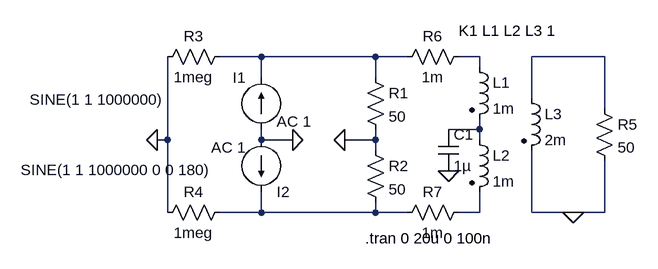
[diagram p0: schematic spice.asc]
spice.asc, the LTspice schematic file:
Version 4
SHEET 1 880 680
WIRE 0 48 -64 48
WIRE 176 48 0 48
WIRE 224 48 176 48
WIRE 336 48 304 48
WIRE 528 48 416 48
WIRE 336 64 336 48
WIRE 0 80 0 48
WIRE 176 80 176 48
WIRE 416 112 416 48
WIRE 528 128 528 48
WIRE 336 160 336 144
WIRE 336 160 288 160
WIRE -144 176 -144 48
WIRE -144 176 -160 176
WIRE 0 176 0 160
WIRE 48 176 0 176
WIRE 176 176 176 160
WIRE 176 176 128 176
WIRE 336 176 336 160
WIRE 176 192 176 176
WIRE -144 288 -144 176
WIRE 0 288 0 256
WIRE 0 288 -64 288
WIRE 176 288 176 272
WIRE 176 288 0 288
WIRE 224 288 176 288
WIRE 336 288 336 256
WIRE 336 288 304 288
WIRE 416 288 416 192
WIRE 480 288 416 288
WIRE 528 288 528 208
WIRE 528 288 480 288
FLAG 48 176 0
FLAG -160 176 0
FLAG 480 288 0
FLAG 128 176 0
FLAG 288 224 0
SYMBOL res 160 64 R0
SYMATTR InstName R1
SYMATTR Value 50
SYMBOL res 160 176 R0
SYMATTR InstName R2
SYMATTR Value 50
SYMBOL current 0 176 R0
WINDOW 0 24 80 Left 2
WINDOW 3 -370 46 Left 2
WINDOW 123 24 -28 Left 2
WINDOW 39 0 0 Left 2
SYMATTR InstName I2
SYMATTR Value SINE(1 1 1000000 0 0 180)
SYMATTR Value2 AC 1
SYMBOL res -48 32 R90
WINDOW 0 0 56 VBottom 2
WINDOW 3 32 56 VTop 2
SYMATTR InstName R3
SYMATTR Value 1meg
SYMBOL res -48 272 R90
WINDOW 0 0 56 VBottom 2
WINDOW 3 32 56 VTop 2
SYMATTR InstName R4
SYMATTR Value 1meg
SYMBOL ind2 320 48 R0
SYMATTR InstName L1
SYMATTR Value 1m
SYMATTR Type ind
SYMBOL ind2 320 160 R0
SYMATTR InstName L2
SYMATTR Value 1m
SYMATTR Type ind
SYMBOL ind2 400 96 R0
SYMATTR InstName L3
SYMATTR Value 2m
SYMATTR Type ind
SYMBOL res 512 112 R0
SYMATTR InstName R5
SYMATTR Value 50
SYMBOL current 0 160 R180
WINDOW 0 24 80 Left 2
WINDOW 3 149 46 Left 2
WINDOW 123 24 -28 Left 2
WINDOW 39 0 0 Left 2
SYMATTR InstName I1
SYMATTR Value SINE(1 1 1000000)
SYMATTR Value2 AC 1
SYMBOL res 320 32 R90
WINDOW 0 0 56 VBottom 2
WINDOW 3 32 56 VTop 2
SYMATTR InstName R6
SYMATTR Value 1m
SYMBOL res 320 272 R90
WINDOW 0 0 56 VBottom 2
WINDOW 3 32 56 VTop 2
SYMATTR InstName R7
SYMATTR Value 1m
SYMBOL cap 272 160 R0
SYMATTR InstName C1
SYMATTR Value 1µ
TEXT 160 328 Left 2 !.tran 0 20u 0 100n
TEXT 304 8 Left 2 !K1 L1 L2 L3 1

The netlist it stands for:
* spice.asc
R1 N001 0 50
R2 0 N005 50
I2 0 N005 SINE(1 1 1000000 0 0 180) AC 1
R3 N001 0 1meg
R4 N005 0 1meg
L1 N002 N004 1m
L2 N004 N006 1m
L3 N003 0 2m
R5 N003 0 50
I1 0 N001 SINE(1 1 1000000) AC 1
R6 N002 N001 1m
R7 N006 N005 1m
C1 N004 0 1µ
.tran 0 20u 0 100n
K1 L1 L2 L3 1
.backanno
.end